# Altium schematic sheet uC.SchDoc
size A3
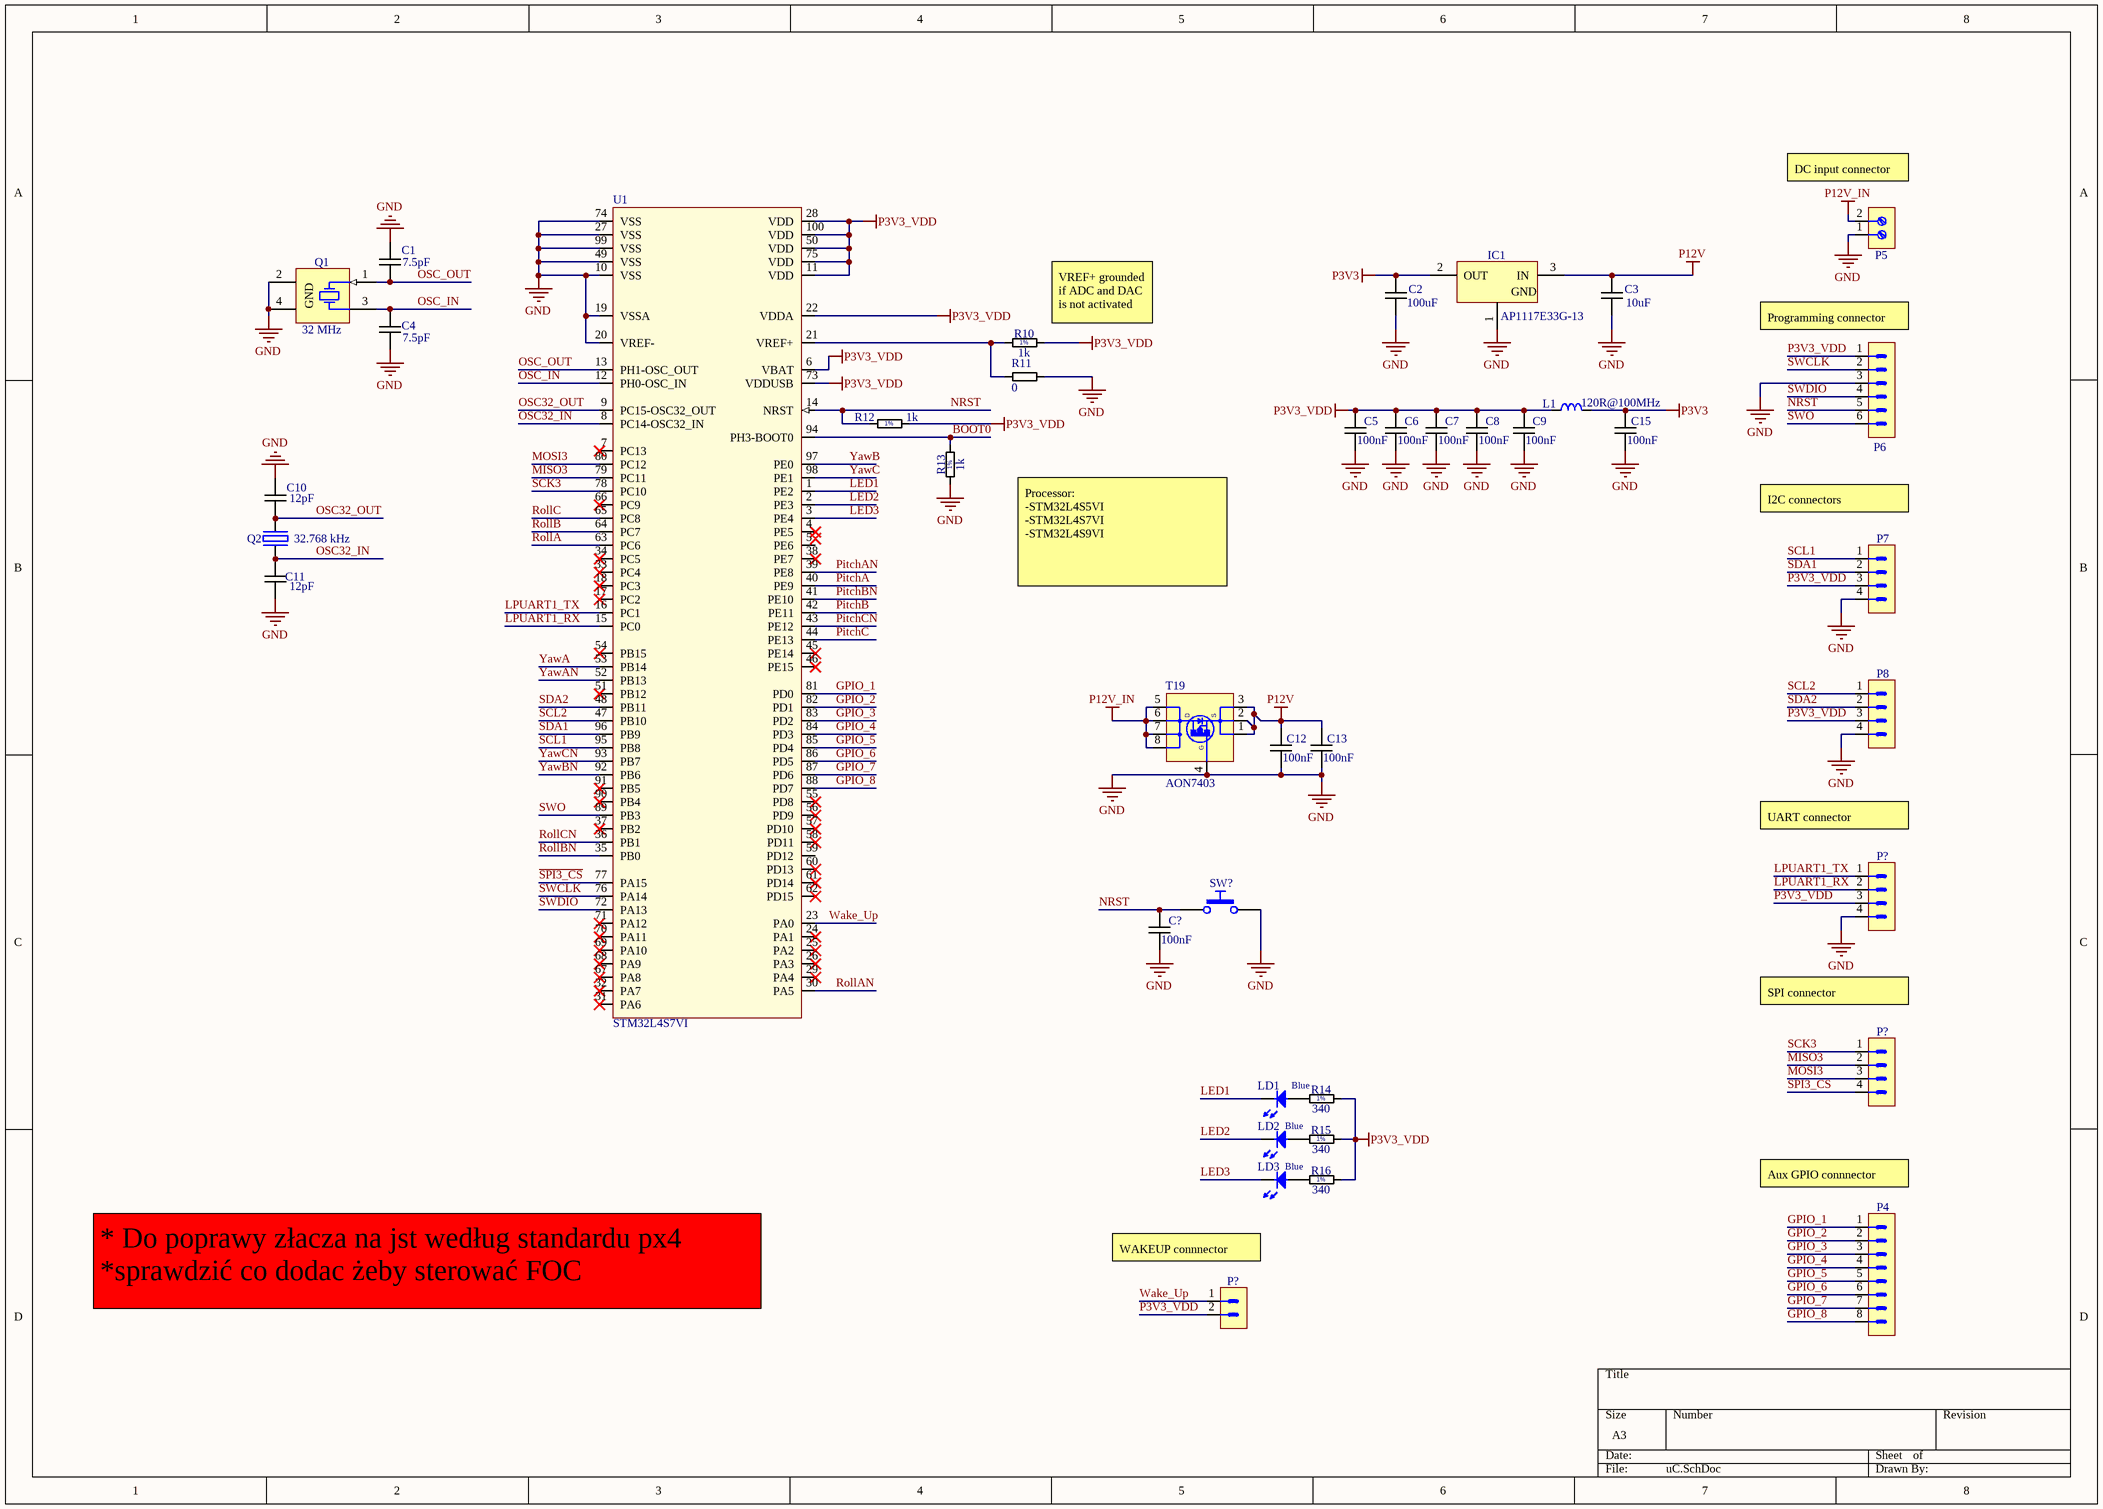
[diagram p0: uC.SchDoc]

## Parts
(Parts that share a designator on the sheet are numbered #1, #2 ... from top to bottom, then left to right.)
C1  7.5pF  [CAPC0402X60N]
C2  100uF  [CAPC1206X100N]
C3  10uF  [CAPC0603X90N]
C4  7.5pF  [CAPC0402X60N]
C5  100nF  [CAPC0402X60N]
C6  100nF  [CAPC0402X60N]
C7  100nF  [CAPC0402X60N]
C8  100nF  [CAPC0402X60N]
C9  100nF  [CAPC0402X60N]
C10  12pF  [CAPC0402X60N]
C11  12pF  [CAPC0402X60N]
C12  100nF  [CAPC0402X60N]
C13  100nF  [CAPC0402X60N]
C15  100nF  [CAPC0402X60N]
C?  100nF  [CAPC0402X60N]
IC1  AP1117E33G-13  [SOT223]
L1  120R@100MHz  [INDC0603X90N]
LD1  Blue  [LED_0805X70N]
LD2  Blue  [LED_0805X70N]
LD3  Blue  [LED_0805X70N]
P4  68000-208HLF  [Header_8x1_V_2.54mm_M]  (value not drawn)
P5  WR-TBL 3114  [PLUGTERM_THT_2X1H_5P08MM]  (value not drawn)
P6  MTLW-106-07-L-S-250  [SAMTEC_MTLW-106-07-L-S-250]  (value not drawn)
P7  B4B-PH-K-S  [B4B-PH-K-S]  (value not drawn)
P8  B4B-PH-K-S  [B4B-PH-K-S]  (value not drawn)
P?#1  B4B-PH-K-S  [B4B-PH-K-S]  (value not drawn)
P?#2  B4B-PH-K-S  [B4B-PH-K-S]  (value not drawn)
P?#3  MTLW-102-07-G-S-250  [SAMTEC_MTLW-102-07-G-S-250]  (value not drawn)
Q1  32 MHz  [HCR2016_N]
Q2  32.768 kHz  [FC-135R_N]
R10  1k  [RESC0402X40N]
R11  0  [RESC0402X40N]
R12  1k  [RESC0402X40N]
R13  1k  [RESC0402X40N]
R14  340  [RESC0402X40N]
R15  340  [RESC0402X40N]
R16  340  [RESC0402X40N]
SW?  PTS636  [PTS636_SMT_G]  (value not drawn)
T19  AON7403  [DFN8_3X3_EP_N]
U1  STM32L4S7VI  [STM-LQFP100_N]

## Nets
GND: C1.2 C2.1 C3.1 C4.1 C5.1 C6.1 C7.1 C8.1 C9.1 C10.2 C11.1 C12.1 C13.1 C15.1 C?.1 IC1.1(GND) P5.1 P6.3 P7.4 P8.4 P?#1.4 Q1.2(GND) Q1.4(GND) R11.2 R13.1 SW?.2 T19.4(G) U1.10(VSS) U1.19(VSSA) U1.20(VREF-) U1.27(VSS) U1.49(VSS) U1.74(VSS) U1.99(VSS)
P3V3: C2.2 C15.2 IC1.2(OUT) L1.2
P3V3_VDD: C5.2 C6.2 C7.2 C8.2 C9.2 L1.1 P6.1 P7.3 P8.3 P?#1.3 P?#3.2 R10.2 R12.2 R14.2 R15.2 R16.2 U1.6(VBAT) U1.11(VDD) U1.22(VDDA) U1.28(VDD) U1.50(VDD) U1.73(VDDUSB) U1.75(VDD) U1.100(VDD)
P12V: C3.2 C12.2 C13.2 IC1.3(IN) T19.1(S) T19.2(S) T19.3(S)
P12V_IN: P5.2 T19.5(D) T19.6(D) T19.7(D) T19.8(D)
BOOT0: R13.2 U1.94(PH3-BOOT0)
GPIO_1: P4.1 U1.81(PD0)
GPIO_2: P4.2 U1.82(PD1)
GPIO_3: P4.3 U1.83(PD2)
GPIO_4: P4.4 U1.84(PD3)
GPIO_5: P4.5 U1.85(PD4)
GPIO_6: P4.6 U1.86(PD5)
GPIO_7: P4.7 U1.87(PD6)
GPIO_8: P4.8 U1.88(PD7)
LED1: LD1.1(C) U1.1(PE2)
LED2: LD2.1(C) U1.2(PE3)
LED3: LD3.1(C) U1.3(PE4)
LPUART1_RX: P?#1.2 U1.15(PC0)
LPUART1_TX: P?#1.1 U1.16(PC1)
MISO3: P?#2.2 U1.79(PC11)
MOSI3: P?#2.3 U1.80(PC12)
NRST: C?.2 P6.5 R12.1 SW?.1 U1.14(NRST)
OSC32_IN: C11.2 Q2.1(OSC1) U1.8(PC14-OSC32_IN)
OSC32_OUT: C10.1 Q2.2(OSC2) U1.9(PC15-OSC32_OUT)
OSC_IN: C4.2 Q1.3(X) U1.12(PH0-OSC_IN)
OSC_OUT: C1.1 Q1.1(X) U1.13(PH1-OSC_OUT)
PitchA: U1.40(PE9)
PitchAN: U1.39(PE8)
PitchB: U1.42(PE11)
PitchBN: U1.41(PE10)
PitchC: U1.44(PE13)
PitchCN: U1.43(PE12)
RollA: U1.63(PC6)
RollAN: U1.30(PA5)
RollB: U1.64(PC7)
RollBN: U1.35(PB0)
RollC: U1.65(PC8)
RollCN: U1.36(PB1)
~{SPI3_CS}: P?#2.4 U1.77(PA15)
SCK3: P?#2.1 U1.78(PC10)
SCL1: P7.1 U1.95(PB8)
SCL2: P8.1 U1.47(PB10)
SDA1: P7.2 U1.96(PB9)
SDA2: P8.2 U1.48(PB11)
SWCLK: P6.2 U1.76(PA14)
SWDIO: P6.4 U1.72(PA13)
SWO: P6.6 U1.89(PB3)
Wake_Up: P?#3.1 U1.23(PA0)
YawA: U1.53(PB14)
YawAN: U1.52(PB13)
YawB: U1.97(PE0)
YawBN: U1.92(PB6)
YawC: U1.98(PE1)
YawCN: U1.93(PB7)
NetLD1_2: LD1.2(A) R14.1
NetLD2_2: LD2.2(A) R15.1
NetLD3_2: LD3.2(A) R16.1
NetR10_1: R10.1 R11.1 U1.21(VREF+)

Not connected (* = marked no-connect by the designer): U1 4(PE5)* 5(PE6) 7(PC13)* 17(PC2)* 18(PC3)* 24(PA1)* 25(PA2)* 26(PA3)* 29(PA4)* 31(PA6)* 32(PA7)* 33(PC4)* 34(PC5)* 37(PB2)* 38(PE7)* 45(PE14)* 46(PE15)* 51(PB12)* 54(PB15)* 55(PD8)* 56(PD9)* 57(PD10)* 58(PD11)* 59(PD12) 60(PD13)* 61(PD14)* 62(PD15)* 66(PC9)* 67(PA8)* 68(PA9)* 69(PA10)* 70(PA11)* 71(PA12)* 90(PB4)* 91(PB5)*

## Notes on the sheet
- (near P5) DC input connector
- (near R10) VREF+ grounded if ADC and DAC is not activated
- (near P6) Programming connector
- I2C connectors
- Processor:
  -STM32L4S5VI
  -STM32L4S7VI
  -STM32L4S9VI
- UART connector
- (near P?#2) SPI connector
- (near P4) Aux GPIO connnector
- WAKEUP connnector
- * Do poprawy złacza na jst według standardu px4          *sprawdzić co dodac żeby sterować FOC

## Library data of the parts
C1 C4 = CC0402_7P5F_50V_5%_C0G: Non-polarised capacitor; Manufacturer: GENERIC; Manufacturer 1 Example: Murata; Manufacturer 1 Part Number: GCM1555C1H7R5DA16D; Manufacturer 1 Component Height: 0.5mm; PressFit: No; Dielectric: C0G; Tolerance: 5%; Voltage: 50V; DesignItemId: CC0402_7P5F_50V_5%_C0G; Author: KB; Case: 0402 (1005 metric); Component Kind: Standard; HelpURL: https://search.murata.co.jp/Ceramy/image/img/A01X/G101/ENG/GJM1555C1H7R5CB01-01.pdf; Manufacturer Part Number: CC0402_7P5F_50V_5%_C0G; Mounted: Yes; Part Description: Non-polarised capacitor; Pin Count: 2; Sense: No; SMD: Yes; Socket: No; Status: Recommended; Value: 7.5pF; Supplier 1: Mouser; Supplier 2: Digi-Key; Create Date: 28.07.2019; LatestRevisionDate: 28.07.2019; Supplier Part Number 1: 81-GCM1555C1H7R5DA6D; Supplier Part Number 2: 490-3108-1-ND
C2 = CC1206_100UF_6V3_20%_X5R: Non-polarised capacitor; Manufacturer: GENERIC; Manufacturer 1 Example: Samsung; Manufacturer 1 Part Number: CL31A107MQHNNNE; Manufacturer 1 Component Height: 1.6mm; PressFit: No; Dielectric: X5R; Tolerance: 20%; Voltage: 6.3V; DesignItemId: CC1206_100UF_6V3_20%_X5R; Author: KB; Case: 1206 (3216 metric); Component Kind: Standard; HelpURL: https://www.vishay.com/docs/28548/vjw1bcbascomseries.pdf; Manufacturer Part Number: CC1206_100UF_6V3_20%_X5R; Mounted: Yes; Part Description: Non-polarised capacitor; Pin Count: 2; Sense: No; SMD: Yes; Socket: No; Status: Recommended; Value: 100uF; Supplier 1: TME; Supplier 2: Mouser; Create Date: 29.07.2019; LatestRevisionDate: 29.07.2019; Supplier Part Number 1: CL31A107MQHNNNE; Supplier Part Number 2: 963-JMK316ABJ107ML-T
C3 = CC0603_10UF_16V_20%_X5R: Non-polarised capacitor; Manufacturer: GENERIC; Manufacturer 1 Example: Samsung; Manufacturer 1 Part Number: CL10A106MO8NQNC; Manufacturer 1 Component Height: 0.8mm; PressFit: No; Dielectric: X5R; Tolerance: 20%; Voltage: 16V; DesignItemId: CC0603_10UF_16V_20%_X5R; Author: KB; Case: 0603 (1608 metric); Component Kind: Standard; HelpURL: https://www.vishay.com/docs/28548/vjw1bcbascomseries.pdf; Manufacturer Part Number: CC0603_10UF_16V_20%_X5R; Mounted: Yes; Part Description: Non-polarised capacitor; Pin Count: 2; Sense: No; SMD: Yes; Socket: No; Status: Recommended; Value: 10uF; Supplier 1: Farnell; Supplier 2: TME; Supplier 3: Mouser; Create Date: 01.04.2019; LatestRevisionDate: 01.04.2019; Supplier Part Number 1: 2611923; Supplier Part Number 2: CL10A106MO8NQNC; Supplier Part Number 3: 81-GRM188R61C106KALD
C5-C9 C12 C13 C15 C? = CC0402_100NF_16V_10%_X7R: Non-polarised capacitor; Manufacturer: GENERIC; Manufacturer 1 Example: Samsung; Manufacturer 1 Part Number: CL05B104KO5NNNC; Manufacturer 1 Component Height: 0.5mm; PressFit: No; Dielectric: X7R; Tolerance: 10%; Voltage: 16V; DesignItemId: CC0402_100NF_16V_10%_X7R; Author: KB; Case: 0402 (1005 metric); Component Kind: Standard; HelpURL: http://www.farnell.com/datasheets/1870456.pdf?_ga=2.66904750.1666480506.1564307475-778048469.1556931874&_gac=1.242951606.1563147047.EAIaIQobChMIrfuAvMi14wIVB-J3Ch1XegfpEAYYASABEgIMVfD_BwE; Manufacturer Part Number: CC0402_100NF_16V_10%_X7R; Mounted: Yes; Part Description: Non-polarised capacitor; Pin Count: 2; Sense: No; SMD: Yes; Socket: No; Status: Recommended; Value: 100nF; Supplier 1: TME; Supplier 2: Farnell; Supplier 3: Mouser; Create Date: 29.07.2019; LatestRevisionDate: 29.07.2019; Supplier Part Number 1: CL05B104KO5NNNC; Supplier Part Number 2: 1758896; Supplier Part Number 3: 710-885012205037
C10 C11 = CC0402_12PF_50V_5%_C0G: Non-polarised capacitor; Manufacturer: GENERIC; Manufacturer 1 Example: Murata; Manufacturer 1 Part Number: GRM1555C1H120JA01D; Manufacturer 1 Component Height: 0.5mm; PressFit: No; Dielectric: C0G; Tolerance: 5%; Voltage: 50V; DesignItemId: CC0402_12PF_50V_5%_C0G; Author: KB; Case: 0402 (1005 metric); Component Kind: Standard; HelpURL: https://search.murata.co.jp/Ceramy/image/img/A01X/G101/ENG/GJM1555C1H7R5CB01-01.pdf; Manufacturer Part Number: CC0402_12PF_50V_5%_C0G; Mounted: Yes; Part Description: Non-polarised capacitor; Pin Count: 2; Sense: No; SMD: Yes; Socket: No; Status: Recommended; Value: 12pF; Supplier 1: TME; Supplier 2: Farnell; Supplier 3: Mouser; Create Date: 28.07.2019; LatestRevisionDate: 28.07.2019; Supplier Part Number 1: GRM1555C1H120JA01D; Supplier Part Number 2: 1758943; Supplier Part Number 3: 81-GCM1555C1H120JA6J
IC1 = AP1117E33G-13: 1A Low dropout positive P3V3 regulator; Manufacturer 1 Example: Diodes Incorporated; Manufacturer 1 Component Height: 1.75mm; PressFit: No; DesignItemId: AP1117E33G-13; Author: JK; Device: AP1117E33G-13; Component Kind: Standard; HelpURL: https://www.tme.eu/Document/601a4b72f2e6cfc100b2c2e81e705fa8/ap1117.pdf; Manufacturer 1 Part Number: AP1117E33G-13; Mounted: Yes; Part Description: 1A Low dropout positive P3V3 regulator; Pin Count: 3; Sense: No; SMD: Yes; Socket: No; Supplier 1: TME; Supplier 2: Farnell; Supplier 3: Mouser; Create Date: 05.09.2019; LatestRevisionDate: 05.09.2019; Supplier Part Number 1: AP1117E33G-13; Supplier Part Number 2: 1825291; Supplier Part Number 3: 621-AP1117E33G-13
L1 = FB0603_120R@100MHZ_2A: Ferrite Bead; Manufacturer: GENERIC; Manufacturer 1 Example: Murata; Manufacturer 1 Part Number: BLM18PG121SN1D; Manufacturer 1 Component Height: 0.8mm; PressFit: No; Tolerance: 25%; DesignItemId: FB0603_120R@100MHZ_2A; Author: KB; Case: 0603 (1608 metric); Component Kind: Standard; HelpURL: https://www.tme.eu/Document/19a35c43258593752611d1c31a7dbf1a/MURATA-BLM18P.pdf; Manufacturer Part Number: FB0603_120R@100MHZ_2A; Mounted: Yes; Part Description: Ferrite Bead; Pin Count: 2; Sense: No; SMD: Yes; Socket: No; Status: Recommended; Value: 120R@100MHz; Supplier 1: Farnell; Supplier 2: TME; Supplier 3: Mouser; Create Date: 01.04.2019; LatestRevisionDate: 01.04.2019; Supplier Part Number 1: 1515738; Supplier Part Number 2: BLM18PG121SN1D; Supplier Part Number 3: 81-BLM18PG121SN1D
LD1-LD3 = LED_0805_V_BLUE: SMD mono-color Chip LED, Blue, 0805; Manufacturer: Generic; Manufacturer 1 Example: Wurth Electronics; Manufacturer 1 Part Number: 150080BS75000; Manufacturer 1 Component Height: 0.7mm; PressFit: No; DesignItemId: LED_0805_V_BLUE; Author: KB; Color: Blue; Component Kind: Standard; Footprint: 805; HelpURL: https://katalog.we-online.com/led/datasheet/150080BS75000.pdf; Mounted: Yes; Part Description: SMD mono-color Chip LED, Blue, 0805; Pin Count: 2; Sense: No; SMD: Yes; Socket: No; Supplier 1: TME; Supplier 2: Mouser; Supplier 3: Farnell; Create Date: 09.04.2019; LatestRevisionDate: 09.04.2019; Supplier Part Number 1: OF-SMD2012B; Supplier Part Number 2: 710-150080BS75000; Supplier Part Number 3: 2322075
P4 = HDR_THT_8X1V_M_2P54MM: General Purpose Header: THT, 2.54mm, Male, Straight; Manufacturer: GENERIC; Manufacturer 1 Example: AMPHENOL; Manufacturer 1 Component Height: 6.7mm; PressFit: No; DesignItemId: HDR_THT_8X1V_M_2P54MM; Author: JK; Family: HTSW; Component Kind: Standard; HelpURL: https://www.tme.eu/Document/deb83b8ba474aa6382ee38bb24abad5e/68000-XXXXLF.pdf; Manufacturer Part Number: Header_8x1_V_2.54mm_M; Manufacturer 1 Part Number: 68000-208HLF; Mounted: Yes; Part Description: General Purpose Header: THT, 2.54mm, Male, Straight; Pin Count: 8; Sense: No; SMD: No; Socket: No; Status: Recommended; Supplier 1: TME; Create Date: 17.12.2019; LatestRevisionDate: 17.12.2019; Supplier Part Number 1: 68000-208HLF
P5 = PLUGTERM_THT_2X1H_5P08MM: Pluggable Terminal Block, Right angle, 2 Positions, THT, Screw Connection, 10.16x8.5mm body; Manufacturer: GENERIC; Manufacturer 1 Example: Ninigi; Manufacturer 1 Part Number: TBG-5-KB-2P-GN; Manufacturer 1 Component Height: 8mm; Part Description: Pluggable Terminal Block, 2 Positions, THT, Screw Connection, 10.16x8.5mm body; Current Max: 15A; PressFit: No; Voltage Max: 300V; DesignItemId: PLUGTERM_THT_2X1H_5P08MM; Author: KB; Family: WR-TBL 3114; Component Kind: Standard; HelpURL: https://pl.mouser.com/datasheet/2/445/6913115000xx-537849.pdf; Manufacturer Part Number: PLUGTERM_THT_2X1H_5P08MM; Mounted: Yes; Pin Count: 2; Sense: No; SMD: No; Socket: No; Status: Recommended; Supplier 1: TME; Supplier 2: Mouser; Supplier 3: Farnell; Create Date: 19.03.2012; LatestRevisionDate: 19.03.2012; Supplier Part Number 1: TBG-5-KB-2P-GN; Supplier Part Number 3: 3882172
P6 = HDR_THT_6X1V_M_2P54MM: General Purpose Header: THT, 2.54mm, Male, Straight; Manufacturer: GENERIC; Manufacturer 1 Example: Samtec; Manufacturer 1 Component Height: 10.92mm; Current Max: 5.2A; PressFit: No; DesignItemId: HDR_THT_6X1V_M_2P54MM; Author: PC; Family: MLTW; Component Kind: Standard; Footprint: HDR_6X1V_M_2P54MM; HelpURL: https://pl.mouser.com/datasheet/2/527/mtlw_th-1370324.pdf; Manufacturer Part Number: HDR_THT_6X1V_M_2P54MM; Manufacturer 1 Part Number: MTLW-106-07-L-S-250; Mounted: Yes; Part Description: General Purpose Header: THT, 2.54mm, Male, Straight; Pin Count: 6; Sense: No; SMD: No; Socket: No; Status: Recommended; Supplier 1: Mouser; Supplier 2: Digi-Key; Create Date: 19.08.2012; LatestRevisionDate: 19.08.2012; Supplier Part Number 1: 200-MTLW10607LS250
P7 P8 P?#1 P?#2 = PH-K-S_4X1V_2P0MM: 2mm header socket, vertical, 4 Positions, THT, 9.9x4.5mm body; Manufacturer: GENERIC; Manufacturer 1 Example: JST; Manufacturer 1 Component Height: 6mm; Current Max: 2A; PressFit: No; Voltage Max: 100V; DesignItemId: PH-K-S_4X1V_2P0MM; Author: KB; Family: PH-K-S; Component Kind: Standard; HelpURL: https://www.tme.eu/Document/bde47a97a79ef7b2143e7f603cd40725/PH.pdf; Manufacturer Part Number: B4B-PH-K-S; Manufacturer 1 Part Number: B4B-PH-K-S; Mounted: Yes; Part Description: 2mm header socket, vertical, 4 Positions, THT, 9.9x4.5mm body; Pin Count: 4; Sense: No; SMD: No; Socket: No; Status: Recommended; Supplier 1: TME; Supplier 2: Farnell; Create Date: 19.03.2012; LatestRevisionDate: 19.03.2012; Supplier Part Number 1: B4B-PH-K-S; Supplier Part Number 2: 9492437
P?#3 = HDR_THT_2X1V_M_2P54MM: General Purpose Header: THT, 2.54mm, Male, Straight; Manufacturer: GENERIC; Manufacturer 1 Example: Samtec; Manufacturer 1 Component Height: 10.92mm; Current Max: 5.2A; PressFit: No; DesignItemId: HDR_THT_2X1V_M_2P54MM; Author: PC; Family: MLTW; Component Kind: Standard; Footprint: HDR_2X1V_M_2P54MM; HelpURL: https://pl.mouser.com/datasheet/2/527/mtlw_th-1370324.pdf; Manufacturer Part Number: HDR_THT_2X1V_M_2P54MM; Manufacturer 1 Part Number: MTLW-102-07-G-S-250; Mounted: Yes; Part Description: General Purpose Header: THT, 2.54mm, Male, Straight; Pin Count: 2; Sense: No; SMD: No; Socket: No; Status: Recommended; Supplier 1: Mouser; Supplier 2: Digi-Key; Supplier 3: Sager Electronics / Sager Electronics; Create Date: 19.08.2013; LatestRevisionDate: 19.08.2013; Supplier Part Number 1: 200-MTLW10207GS250
Q1 = XTAL_32MHZ_30PPM_6PF_MURATA_XRCGB32M000F3N00R0: ±30ppm 6pF -40°C to +85°C  4 Pins, 2x1.6X0.7mm, SMD Seam Sealing Crystal; Manufacturer 1 Example: Murata; Manufacturer 1 Component Height: 0.7mm; PressFit: No; DesignItemId: XTAL_32MHZ_30PPM_6PF_MURATA_XRCGB32M000F3N00R0; Author: KB; Value: 32 MHz; Component Kind: Standard; Footprint: HCR2016; HelpURL: https://pl.mouser.com/datasheet/2/281/p79e-806516.pdf; Manufacturer 1 Part Number: XRCGB32M000F3N00R0; Mounted: Yes; Part Description: ±30ppm 6pF -40°C to +85°C  4 Pins, 2x1.6X0.7mm, SMD Seam Sealing Crystal; Pin Count: 4; Sense: No; SMD: Yes; Socket: No; Supplier 1: Farnell; Supplier 2: Mouser; Supplier 3: Arrow; Create Date: 19.07.2028; LatestRevisionDate: 19.07.2028; Supplier Part Number 3: XRCGB32M000F3N00R0; Supplier Part Number 2: 81-XRCGB32M000F3N0R0; Supplier Part Number 1: 2909962
Q2 = XTAL_32.768KHZ_20PPM_9PF_EPSON_FC-135 32.7680KA-AC3: ±20ppm 9pF -40°C to +85°C  2 Pins, 3.2x1.5X0.8mm, SMD Seam Sealing Crystal; Manufacturer 1 Example: Epson; Manufacturer 1 Component Height: 0.8mm; PressFit: No; DesignItemId: XTAL_32.768KHZ_20PPM_9PF_EPSON_FC-135 32.7680KA-AC3; Author: KB; Value: 32.768 kHz; Component Kind: Standard; Footprint: FC-135R; HelpURL: https://pl.mouser.com/datasheet/2/137/C-135R_en-1109071.pdf; Manufacturer 1 Part Number: FC-135 32.7680KA-AC3; Mounted: Yes; Part Description: ±20ppm 9pF -40°C to +85°C  2 Pins, 3.2x1.5X0.8mm, SMD Seam Sealing Crystal; Pin Count: 2; Sense: No; SMD: Yes; Socket: No; Supplier 1: Mouser; Supplier 2: Dig-Key; Supplier 3: Farnell; Create Date: 19.07.2028; LatestRevisionDate: 19.07.2028; Supplier Part Number 3: 2819305; Supplier Part Number 2: SER4085TR-ND; Supplier Part Number 1: 732-FC135-32.76KAAC3
R10 R12 R13 = R0402_1K00_0.0625W_100PPM: General Purpose Thick Film Chip Resistor; Manufacturer: GENERIC; Manufacturer Part Number: R0402_1K00_0.0625W 0.1W 0.125W 0.25W 0.5W 1W 0.75W 1W_100PPM; Manufacturer 1 Example: Vishay; Manufacturer 1 Part Number: CRCW04021K00FKEDC; Manufacturer 1 Component Height: 0.4mm; Power: 62.5mW; Current Max: 0; PressFit: No; TC: ±100 ppm/°C; Tolerance: 1%; Voltage: 50V; DesignItemId: R0402_1K00_0.0625W_100PPM; Author: KB; Case: 0402 (1005 metric); Component Kind: Standard; Component Type: Standard; HelpURL: https://www.vishay.com/docs/20035/dcrcwe3.pdf; Mounted: Yes; Part Description: General Purpose Thick Film Chip Resistor; Pin Count: 2; Sense: No; SMD: Yes; Socket: No; Status: Recommended; Value: 1k; Supplier 1: Farnell; Supplier 2: Mouser; Supplier 3: TME; Create Date: 03.07.2019; LatestRevisionDate: 03.07.2019; Supplier Part Number 3: CRCW04021K00FKED; Supplier Part Number 2: 71-CRCW0402-1.0K-E3
R11 = R0402_0R_JUMPER: General Purpose Thick Film Chip Resistor; Manufacturer: GENERIC; Manufacturer 1 Example: Vishay; Manufacturer 1 Part Number: CRCW04020000Z0EDC; Manufacturer 1 Component Height: 0.4mm; Current Max: 1; PressFit: No; Tolerance: 20mOhm; Voltage: 50V; DesignItemId: R0402_0R_JUMPER; Author: KB; Case: 0402 (1005 metric); Component Kind: Standard; Component Type: Standard; HelpURL: https://www.vishay.com/docs/20035/dcrcwe3.pdf; Manufacturer Part Number: R0402_0R_JUMPER; Mounted: Yes; Part Description: General Purpose Thick Film Chip Resistor; Pin Count: 2; Power: -; Sense: No; SMD: Yes; Socket: No; Status: Recommended; TC: -; Value: 0; Supplier 1: Mouser; Supplier 2: Farnell; Supplier 3: TME; Create Date: 03.07.2019; LatestRevisionDate: 03.07.2019; Supplier Part Number 3: CRCW04020000Z0E; Supplier Part Number 2: 1469661RL
R14-R16 = R0402_340R_0.0625W_100PPM: General Purpose Thick Film Chip Resistor; Manufacturer: GENERIC; Manufacturer Part Number: R0402_340R_0.0625W 0.1W 0.125W 0.25W 0.5W 1W 0.75W 1W_100PPM; Manufacturer 1 Example: Vishay; Manufacturer 1 Part Number: CRCW0402340RFKEDC; Manufacturer 1 Component Height: 0.4mm; Power: 62.5mW; Current Max: 0; PressFit: No; TC: ?100 ppm/?C; Tolerance: 1%; Voltage: 50V; DesignItemId: R0402_340R_0.0625W_100PPM; Author: KB; Case: 0402 (1005 metric); Component Kind: Standard; Component Type: Standard; HelpURL: https://www.vishay.com/docs/20035/dcrcwe3.pdf; Mounted: Yes; Part Description: General Purpose Thick Film Chip Resistor; Pin Count: 2; Sense: No; SMD: Yes; Socket: No; Status: Recommended; Value: 340; Supplier 1: Farnell; Supplier 2: TME; Supplier 3: Mouser; Create Date: 03.07.2019; LatestRevisionDate: 03.07.2019
SW? = SMD_TACT_6P0X3P5MM: Tactile Switches Tact 50mA 12VDC, 6.0x3.5, 4.3mm H, 180gf, G leads, No ground pin, Black Actuator; Manufacturer: C&K; Manufacturer Part Number: PTS636 SM43 SMTR LFS; Manufacturer 1 Example: S&K; PressFit: No; DesignItemId: SMD_TACT_6P0X3P5MM; Author: KB; Family: PTS636; Component Kind: Standard; HelpURL: https://pl.mouser.com/datasheet/2/60/pts636-1550567.pdf; Manufacturer 1 Part Number: PTS636 SM43 SMTR LFS; Manufacturer 1 Component Height: 4.3mm; Mounted: Yes; Part Description: Tactile Switches Tact 50mA 12VDC, 6.0x3.5, 4.3mm H, 180gf, G leads, No ground pin, Black Actuator; Pin Count: 2; Sense: No; SMD: Yes; Socket: No; Status: Recommended; Supplier 1: Mouser; Supplier 2: Digi-Key; Create Date: 30.07.2019; LatestRevisionDate: 30.07.2019; Supplier Part Number 1: 611-PTS636SM43SMTRLF
T19 = AON7403: P-MOS 30V 29A 18mOhm 18nC 10W; Manufacturer 1 Example: Alpha & Omega; Manufacturer 1 Component Height: 0.8mm; Part Description: P-MOS 30V 29A 18mOhm 18nC 10W Logic Level; PressFit: No; ComponentLink1Description: datasheet; ComponentLink1URL: https://www.tme.eu/Document/363b9a549523e3a7ed27f59969586870/AON7403-DTE.pdf; Supplier 1: TME; Manufacturer 1: *; Supplier Part Number 1: AON7403; Manufacturer Part Number 1: *; DesignItemId: AON7403; Author: BS; Device: AON7403; Component Kind: Standard; HelpURL: https://www.tme.eu/Document/363b9a549523e3a7ed27f59969586870/AON7403-DTE.pdf; Manufacturer 1 Part Number: AON7403; Mounted: Yes; Pin Count: 8; Sense: No; SMD: Yes; Socket: No; Create Date: 30.09.2019; LatestRevisionDate: 30.09.2019
U1 = STM32L4S7VI: ARM Microcontrollers - MCU Ultra-low-power with FPU ARM Cortex-M4 MCU 120 MHz with 2048 kbytes Flash, USB OTG, DFSDM, LCD-TFT, AES-256, HASH; Manufacturer: STMicroelectronics; Manufacturer 1 Component Height: 1.6mm; Device: STM32L4S7VIT6; PressFit: No; DesignItemId: STM32L4S7VI; Author: JK; Component Kind: Standard; Footprint: LQFP-100; HelpURL: https://pl.mouser.com/datasheet/2/389/stm32l4s5ai-1309291.pdf; Manufacturer Part Number: STM32L4S7VIT6; Mounted: Yes; Part Description: ARM Microcontrollers - MCU Ultra-low-power with FPU ARM Cortex-M4 MCU 120 MHz with 2048 kbytes Flash, USB OTG, DFSDM, LCD-TFT, AES-256, HASH; Pin Count: 100; Sense: No; SMD: Yes; Socket: No; Supplier 1: Mouser; Supplier 2: Digi-Key; Create Date: 30-08-19; LatestRevisionDate: 30-08-19; Supplier Part Number 2: 497-19209-ND; Supplier Part Number 1: 511-STM32L4S7VIT6